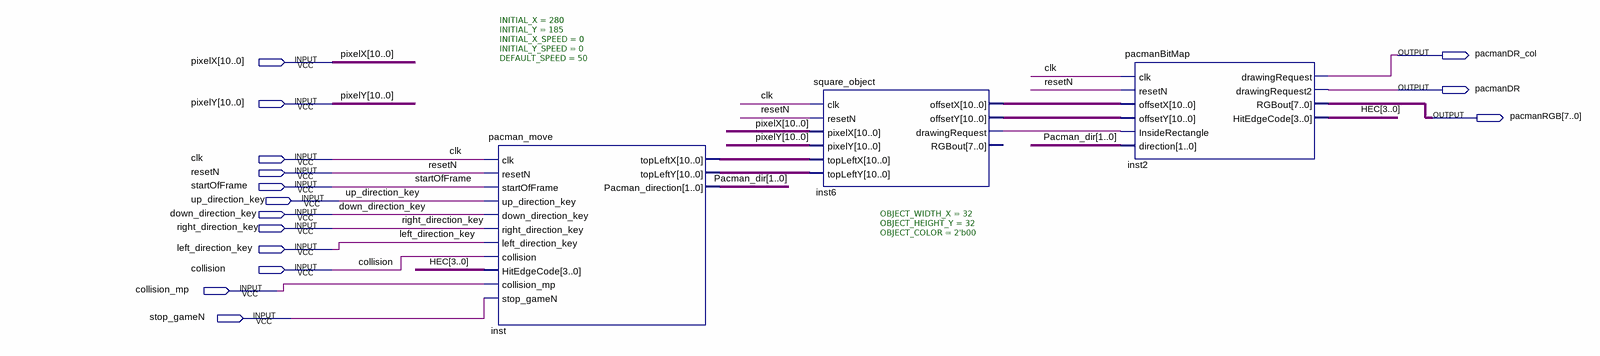
[diagram p0: schematic sheet]
// Quartus schematic Pacman_Block_T.bdf as structural Verilog: 3 symbols, 15 pins
module Pacman_Block_T (
  input  [10:0] pixelX,
  input  [10:0] pixelY,
  input  clk,
  input  resetN,
  input  startOfFrame,
  input  up_direction_key,
  input  down_direction_key,
  input  right_direction_key,
  input  left_direction_key,
  input  collision,
  input  collision_mp,
  input  stop_gameN,
  output pacmanDR_col,
  output pacmanDR,
  output [7:0] pacmanRGB
);

  wire inst6_drawingrequest;
  wire [1:0] Pacman_dir;
  wire [3:0] HEC;
  wire [10:0] inst6_offsetx, inst6_offsety, inst_topleftx, inst_toplefty;

  pacman_move #(.INITIAL_X(280), .INITIAL_Y(185), .INITIAL_X_SPEED(0), .INITIAL_Y_SPEED(0), .DEFAULT_SPEED(50)) inst (
    .clk(clk), .resetN(resetN), .startOfFrame(startOfFrame), .up_direction_key(up_direction_key),
    .down_direction_key(down_direction_key), .right_direction_key(right_direction_key),
    .left_direction_key(left_direction_key), .collision(collision), .HitEdgeCode(HEC),
    .collision_mp(collision_mp), .stop_gameN(stop_gameN), .topLeftX(inst_topleftx), .topLeftY(inst_toplefty),
    .Pacman_direction(Pacman_dir));
  square_object #(.OBJECT_WIDTH_X(32), .OBJECT_HEIGHT_Y(32), .OBJECT_COLOR(2'b00)) inst6 (
    .clk(clk), .resetN(resetN), .pixelX(pixelX), .pixelY(pixelY), .topLeftX(inst_topleftx),
    .topLeftY(inst_toplefty), .offsetX(inst6_offsetx), .offsetY(inst6_offsety),
    .drawingRequest(inst6_drawingrequest));  // open: RGBout
  pacmanBitMap inst2 (
    .clk(clk), .resetN(resetN), .offsetX(inst6_offsetx), .offsetY(inst6_offsety),
    .InsideRectangle(inst6_drawingrequest), .direction(Pacman_dir), .drawingRequest(pacmanDR_col),
    .drawingRequest2(pacmanDR), .RGBout(pacmanRGB), .HitEdgeCode(HEC));
endmodule
